# Altium schematic sheet ESC.SchDoc
size A
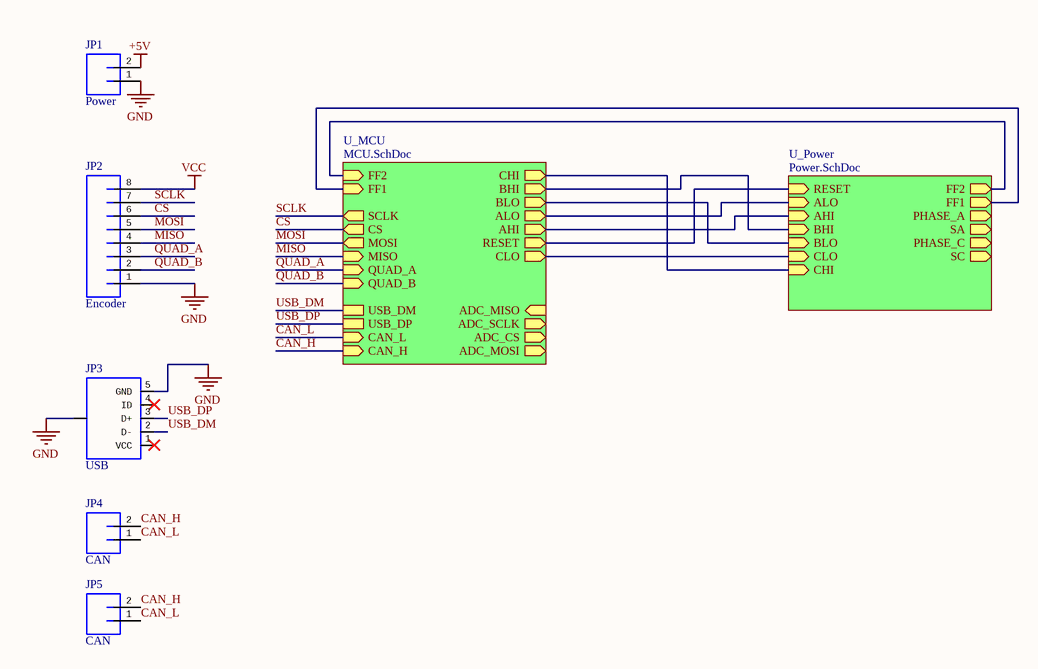
[diagram p0: ESC.SchDoc]

## Parts
JP1  Power  [JST-2-PTH-VERT]
JP2  Encoder  [JST-8-PTH-VERT]
JP3  USB  [USB-MICROB]
JP4  CAN  [JST-2-PTH-VERT]
JP5  CAN  [JST-2-PTH-VERT]

## Sub-sheets
U_MCU = MCU.SchDoc: CHI (out), BHI (out), BLO (out), FF2 (in), FF1 (in), ALO (out), AHI (out), RESET (out), CLO (out), MISO (in), SCLK (out), CS (out), QUAD_A (in), QUAD_B (in), MOSI (out), ADC_MISO (in), ADC_SCLK (out), ADC_CS (out), ADC_MOSI (out), USB_DM, USB_DP, CAN_L (in), CAN_H (in)
U_Power = Power.SchDoc: RESET (in), FF2 (out), ALO (in), FF1 (out), AHI (in), BHI (in), BLO (in), CLO (in), CHI (in), PHASE_A (out), SA (out), SC (out), PHASE_C (out)

## Nets
+5V: JP1.2
GND: JP1.1 JP2.1 JP3.5(GND) JP3.6(SHIELD)
VCC: JP2.8
CAN_H: JP4.2 JP5.2 ; sheet U_MCU/CAN_H
CAN_L: JP4.1 JP5.1 ; sheet U_MCU/CAN_L
CS: JP2.6 ; sheet U_MCU/CS
MISO: JP2.4 ; sheet U_MCU/MISO
MOSI: JP2.5 ; sheet U_MCU/MOSI
QUAD_A: JP2.3 ; sheet U_MCU/QUAD_A
QUAD_B: JP2.2 ; sheet U_MCU/QUAD_B
SCLK: JP2.7 ; sheet U_MCU/SCLK
USB_DM: JP3.2(D-) ; sheet U_MCU/USB_DM
USB_DP: JP3.3(D+) ; sheet U_MCU/USB_DP
(unnamed): sheet U_Power/RESET, sheet U_MCU/RESET
(unnamed): sheet U_Power/FF2, sheet U_MCU/FF2
(unnamed): sheet U_Power/ALO, sheet U_MCU/ALO
(unnamed): sheet U_Power/FF1, sheet U_MCU/FF1
(unnamed): sheet U_Power/AHI, sheet U_MCU/AHI
(unnamed): sheet U_Power/BHI, sheet U_MCU/BHI
(unnamed): sheet U_Power/BLO, sheet U_MCU/BLO
(unnamed): sheet U_Power/CLO, sheet U_MCU/CLO
(unnamed): sheet U_Power/CHI, sheet U_MCU/CHI

Not connected (* = marked no-connect by the designer): JP3 1(VCC)* 4(ID)*

## Library data of the parts
JP1 JP4 JP5 = JST_2_VERT
JP2 = JST_8_VERT
JP3 = USB_MICROB_PLUG-SMT: pin to pad: 1>VBUS 2>D- 3>D+ 4>ID 5>GND 6>MT1+P$1+P$2+MT2; PROD_ID: CONN-09900